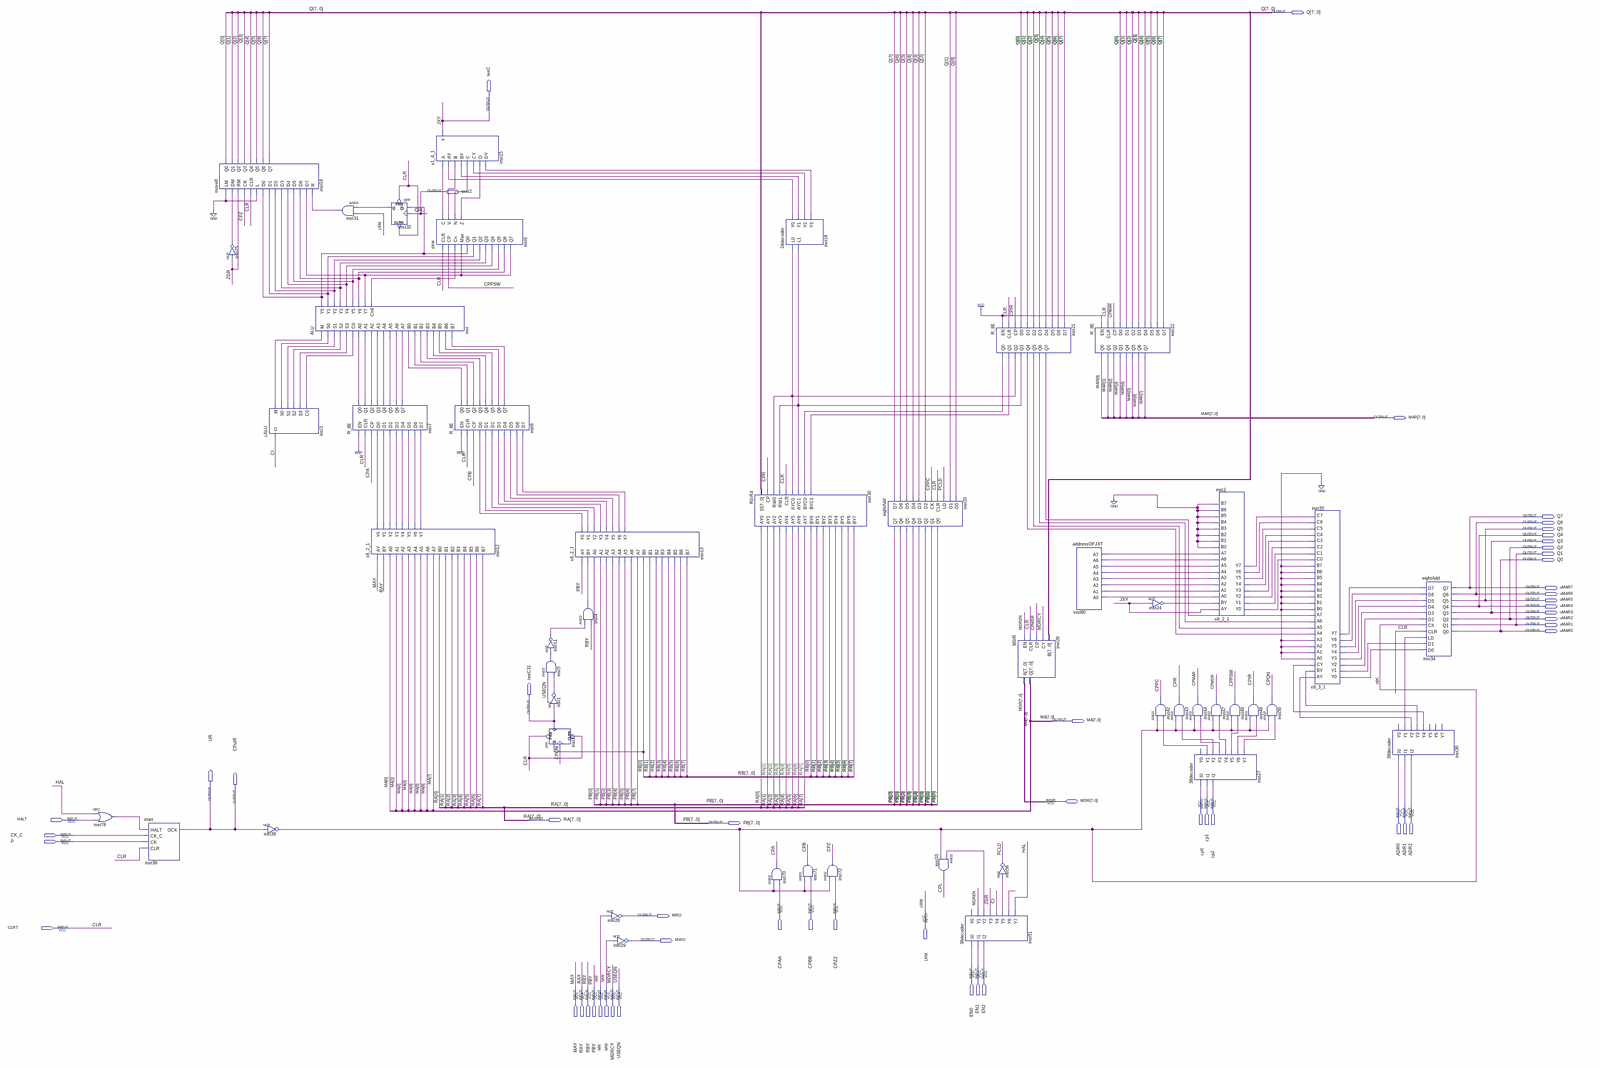
[diagram p0: schematic sheet, whole]
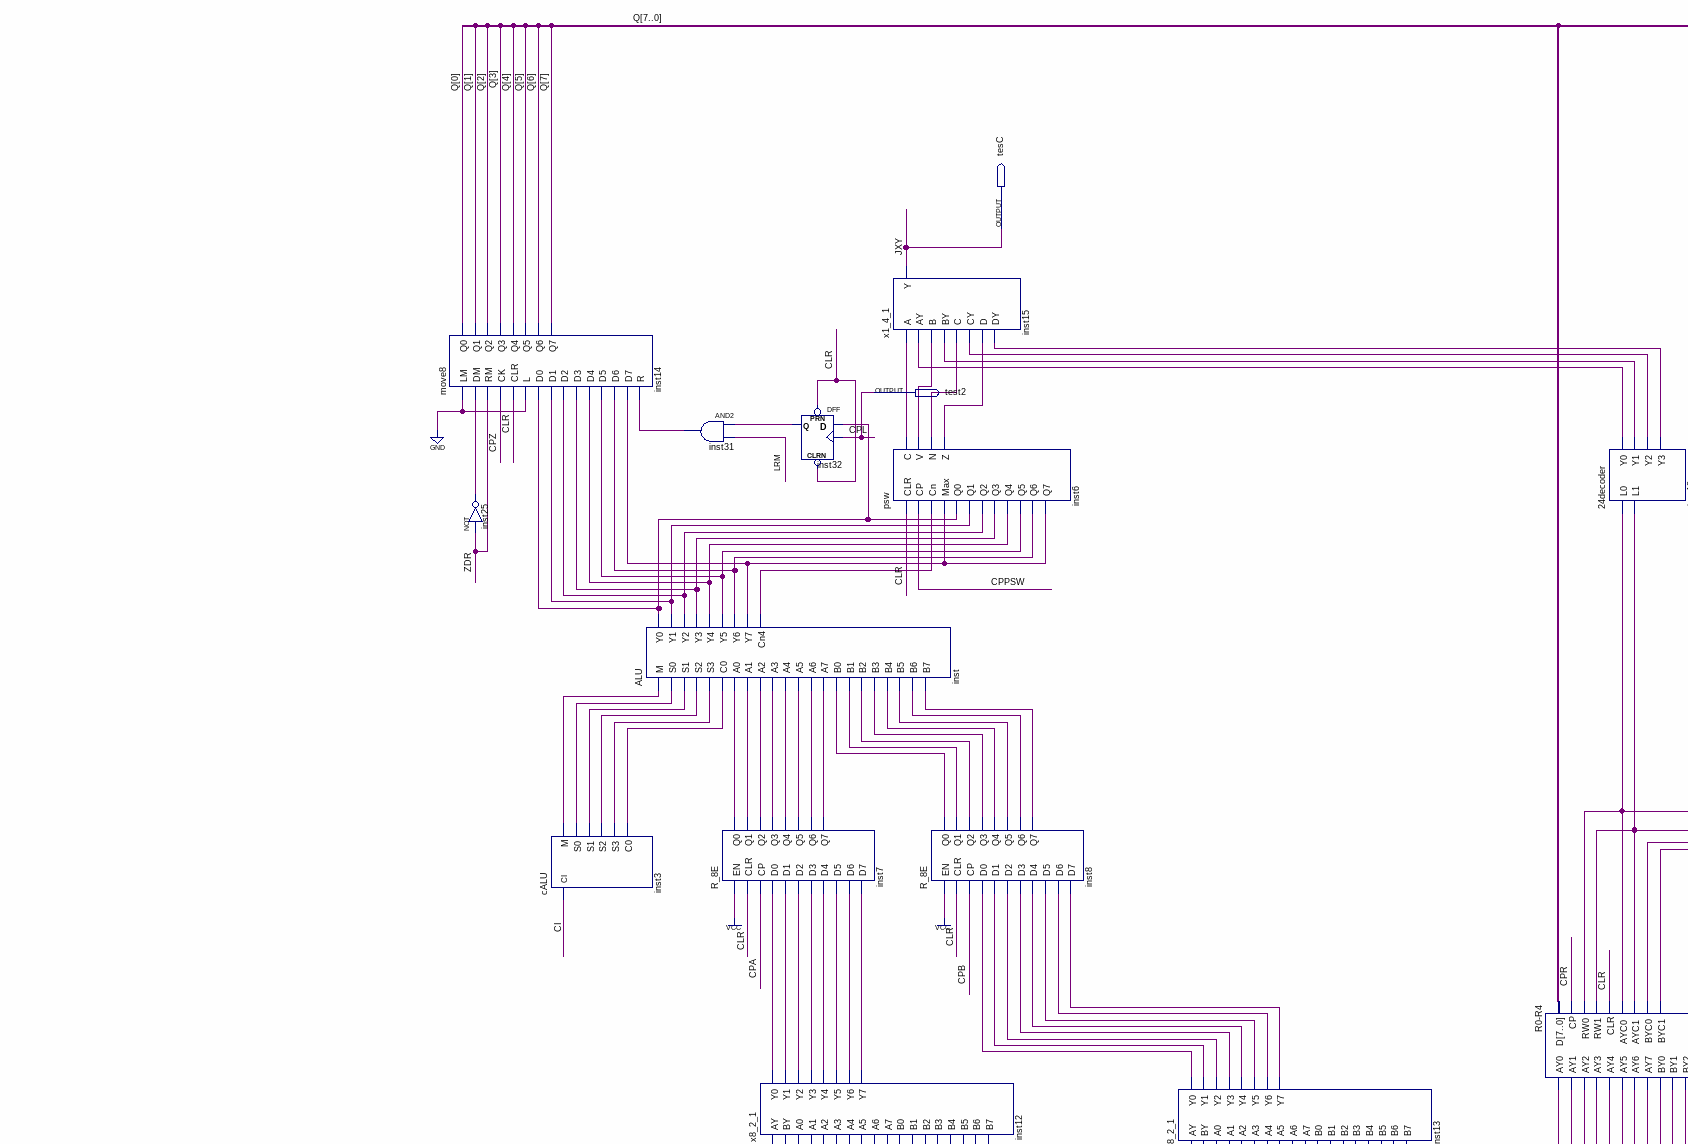
[diagram p1: schematic sheet, upper left part]
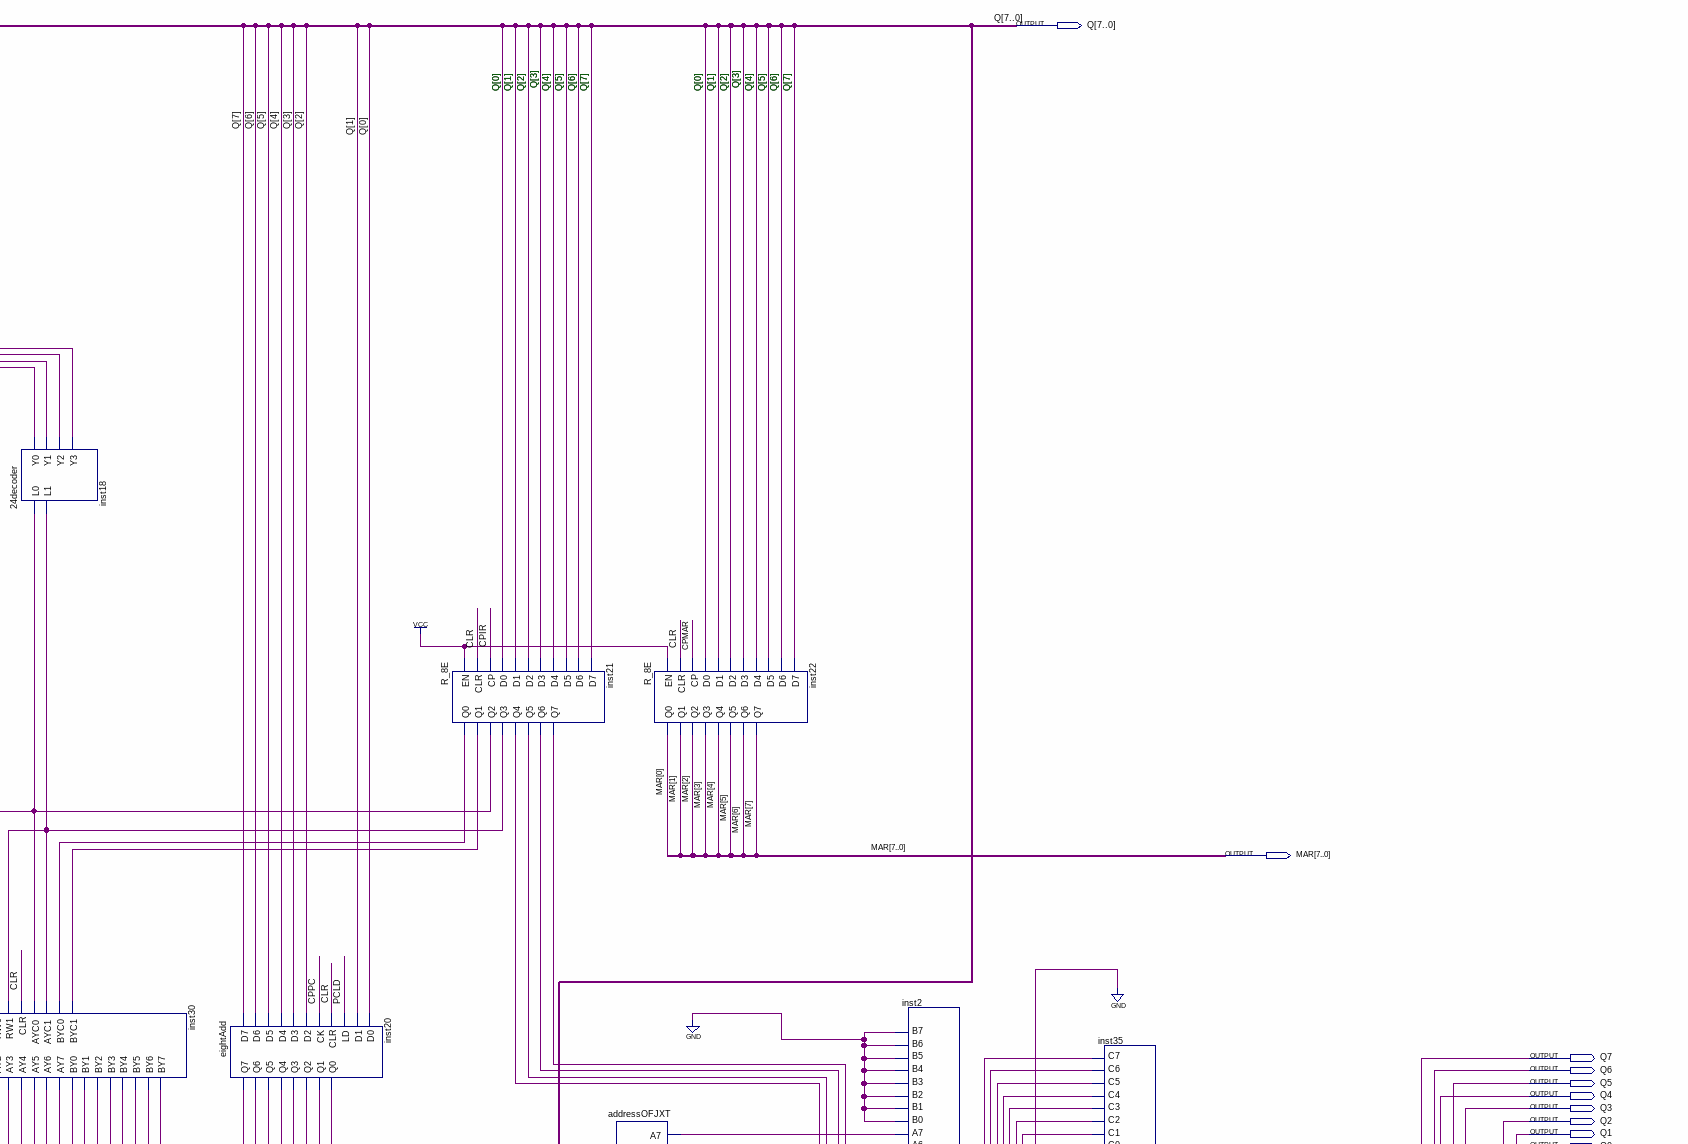
[diagram p2: schematic sheet, upper right part]
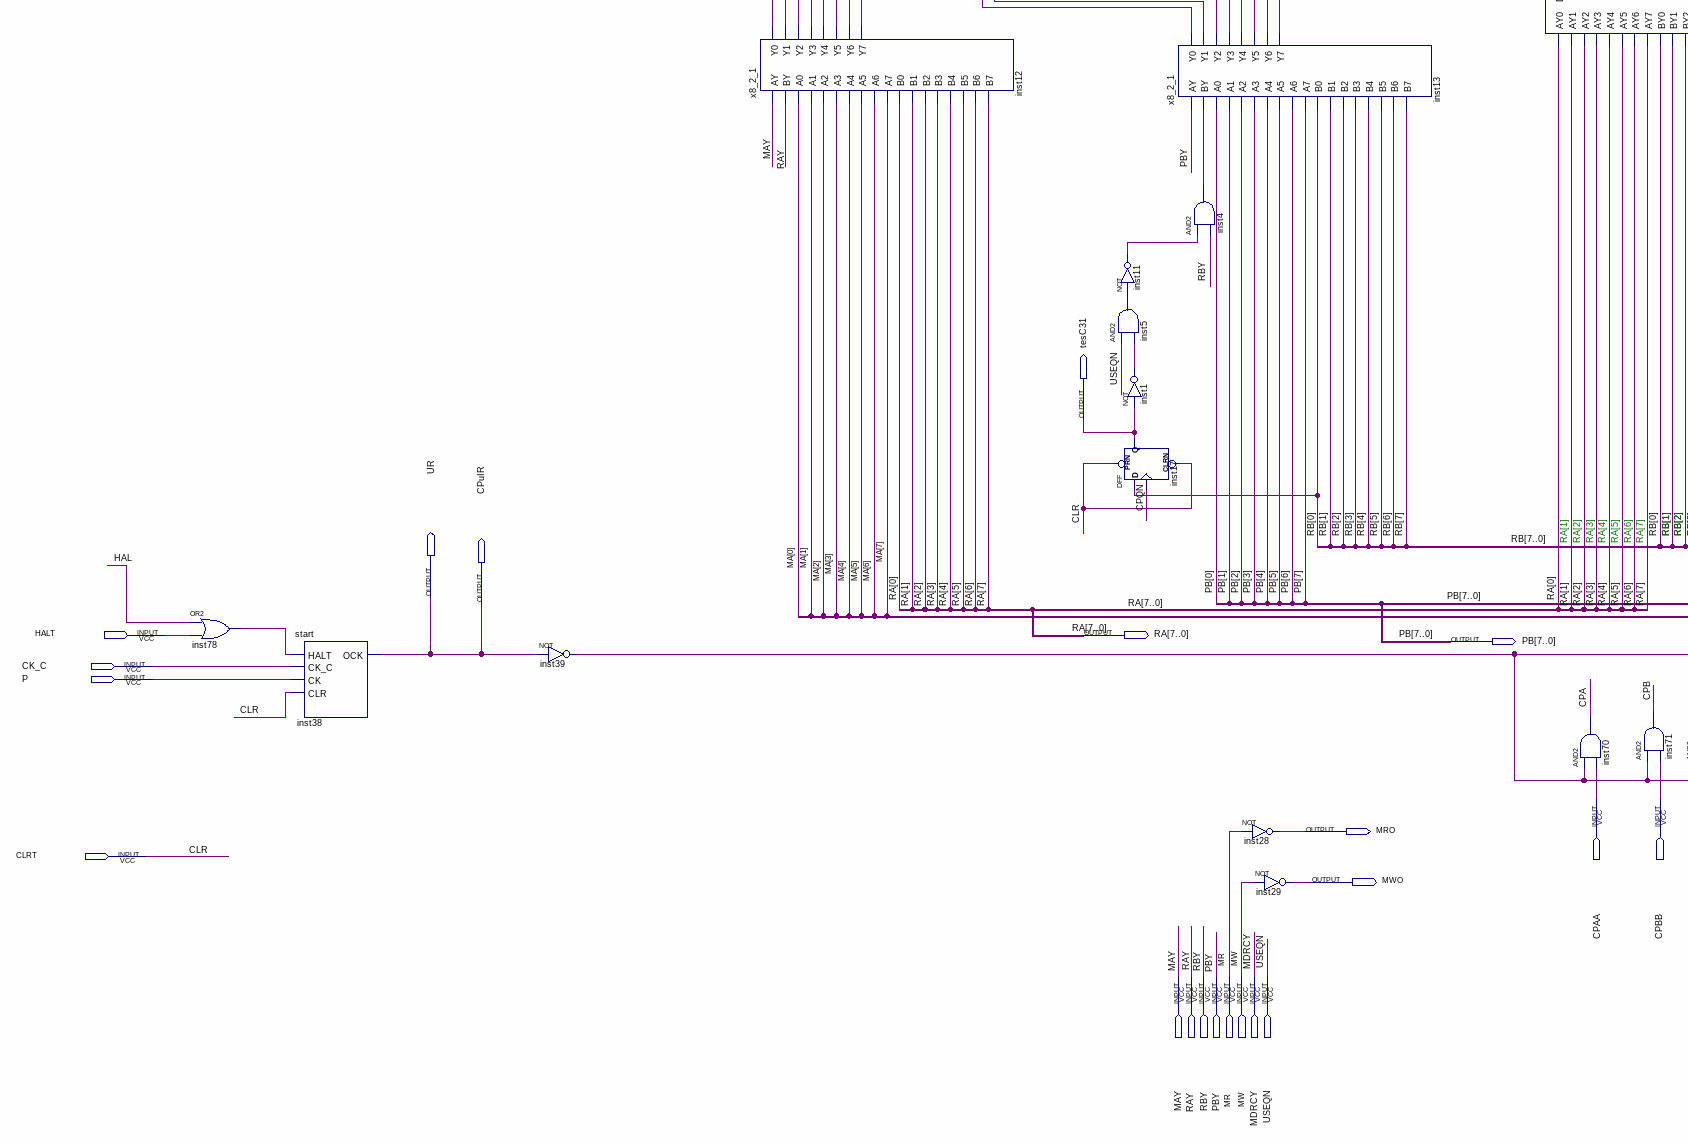
[diagram p3: schematic sheet, lower left part]
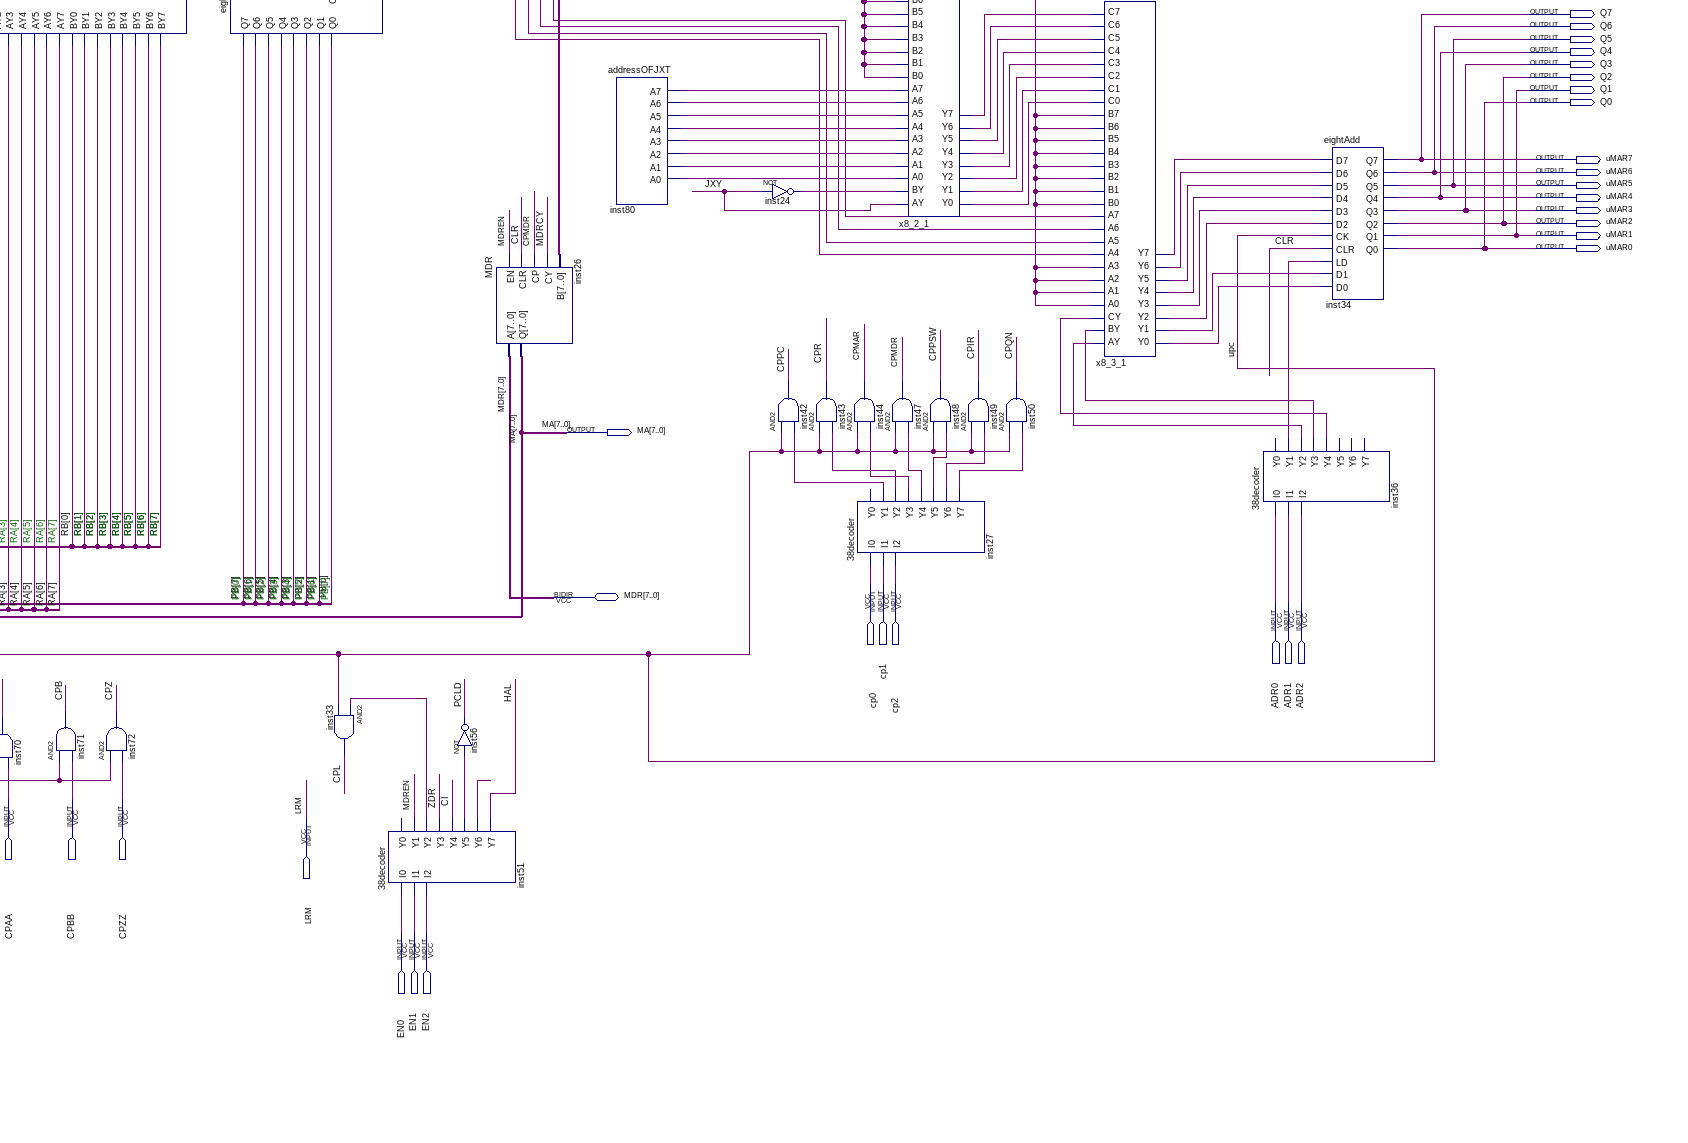
[diagram p4: schematic sheet, lower right part]
// Quartus schematic simpleMachine.bdf as structural Verilog: 48 symbols, 54 pins
module simpleMachine (
  input  cp0,
  input  cp1,
  input  cp2,
  input  ADR0,
  input  ADR1,
  input  ADR2,
  input  HALT,
  input  CK_C,
  input  P,
  input  CPAA,
  input  CPBB,
  input  CPZZ,
  input  LRM,
  input  CLRT,
  input  EN0,
  input  EN1,
  input  EN2,
  input  MAY,
  input  RAY,
  input  RBY,
  input  PBY,
  input  MR,
  input  MW,
  input  MDRCY,
  input  USEQN,
  inout  [7:0] MDR,
  output [7:0] Q,
  output tesC,
  output test2,
  output [7:0] MAR,
  output Q7,
  output Q6,
  output Q5,
  output Q4,
  output Q3,
  output Q2,
  output Q1,
  output Q0,
  output uMAR7,
  output uMAR6,
  output uMAR5,
  output uMAR4,
  output uMAR3,
  output uMAR2,
  output uMAR1,
  output uMAR0,
  output tesC31,
  output [7:0] MA,
  output UR,
  output CPuIR,
  output [7:0] RA,
  output [7:0] PB,
  output MRO,
  output MWO
);

  wire CI, CPA, CPB, CPIR, CPMAR, CPMDR, CPPC, CPPSW, CPQN, CPR, CPZ, HAL, inst1_out, inst2_y0, inst2_y1,
       inst2_y2, inst2_y3, inst2_y4, inst2_y5, inst2_y6, inst2_y7, inst3_c0, inst3_m, inst3_s0, inst3_s1,
       inst3_s2, inst3_s3, inst4_out, inst5_out, inst6_c, inst6_n, inst6_v, inst6_z, inst7_q0, inst7_q1,
       inst7_q2, inst7_q3, inst7_q4, inst7_q5, inst7_q6, inst7_q7, inst8_q0, inst8_q1, inst8_q2, inst8_q3,
       inst8_q4, inst8_q5, inst8_q6, inst8_q7, inst11_out, inst12_y0, inst12_y1, inst12_y2, inst12_y3,
       inst12_y4, inst12_y5, inst12_y6, inst12_y7, inst13_y0, inst13_y1, inst13_y2, inst13_y3, inst13_y4,
       inst13_y5, inst13_y6, inst13_y7, inst18_y0, inst18_y1, inst18_y2, inst18_y3, inst21_q0, inst21_q1,
       inst21_q2, inst21_q3, inst21_q4, inst21_q5, inst21_q6, inst21_q7, inst24_out, inst25_out, inst27_y1,
       inst27_y2, inst27_y3, inst27_y4, inst27_y5, inst27_y6, inst27_y7, inst31_out, inst32_q, inst35_y0,
       inst35_y1, inst35_y2, inst35_y3, inst35_y4, inst35_y5, inst35_y6, inst35_y7, inst36_y1, inst36_y2,
       inst36_y3, inst36_y4, inst51_y2, inst51_y5, inst51_y6, inst78_out, inst80_a0, inst80_a1, inst80_a2,
       inst80_a3, inst80_a4, inst80_a5, inst80_a6, inst80_a7, inst_cn4, inst_y0, inst_y1, inst_y2, inst_y3,
       inst_y4, inst_y5, inst_y6, inst_y7, MDREN, PCLD, upc, ZDR;
  wire [7:0] RB;

  or inst78 (inst78_out, HAL, HALT);
  start inst38 (.HALT(inst78_out), .CK_C(CK_C), .CK(P), .CLR(CLRT), .OCK(CPuIR));
  move8 inst14 (
    .LM(1'b0), .DM(inst25_out), .RM(ZDR), .CK(CPZ), .CLR(CLRT), .L(1'b0), .D0(inst_y0), .D1(inst_y1),
    .D2(inst_y2), .D3(inst_y3), .D4(inst_y4), .D5(inst_y5), .D6(inst_y6), .D7(inst_y7), .R(inst31_out),
    .Q0(Q[0]), .Q1(Q[1]), .Q2(Q[2]), .Q3(Q[3]), .Q4(Q[4]), .Q5(Q[5]), .Q6(Q[6]), .Q7(Q[7]));
  not inst25 (inst25_out, ZDR);
  cALU inst3 (.CI(CI), .M(inst3_m), .S0(inst3_s0), .S1(inst3_s1), .S2(inst3_s2), .S3(inst3_s3), .C0(inst3_c0));
  not inst39 (upc, CPuIR);
  ALU inst (
    .M(inst3_m), .S0(inst3_s0), .S1(inst3_s1), .S2(inst3_s2), .S3(inst3_s3), .C0(inst3_c0), .A0(inst7_q0),
    .A1(inst7_q1), .A2(inst7_q2), .A3(inst7_q3), .A4(inst7_q4), .A5(inst7_q5), .A6(inst7_q6), .A7(inst7_q7),
    .B0(inst8_q0), .B1(inst8_q1), .B2(inst8_q2), .B3(inst8_q3), .B4(inst8_q4), .B5(inst8_q5), .B6(inst8_q6),
    .B7(inst8_q7), .Y0(inst_y0), .Y1(inst_y1), .Y2(inst_y2), .Y3(inst_y3), .Y4(inst_y4), .Y5(inst_y5),
    .Y6(inst_y6), .Y7(inst_y7), .Cn4(inst_cn4));
  and inst31 (inst31_out, inst32_q, LRM);
  R_8E inst7 (
    .EN(1'b1), .CLR(CLRT), .CP(CPA), .D0(inst12_y0), .D1(inst12_y1), .D2(inst12_y2), .D3(inst12_y3),
    .D4(inst12_y4), .D5(inst12_y5), .D6(inst12_y6), .D7(inst12_y7), .Q0(inst7_q0), .Q1(inst7_q1),
    .Q2(inst7_q2), .Q3(inst7_q3), .Q4(inst7_q4), .Q5(inst7_q5), .Q6(inst7_q6), .Q7(inst7_q7));
  x8_2_1 inst12 (
    .AY(MAY), .BY(RAY), .A0(MA[0]), .A1(MA[1]), .A2(MA[2]), .A3(MA[3]), .A4(MA[4]), .A5(MA[5]), .A6(MA[6]),
    .A7(MA[7]), .B0(RA[0]), .B1(RA[1]), .B2(RA[2]), .B3(RA[3]), .B4(RA[4]), .B5(RA[5]), .B6(RA[6]),
    .B7(RA[7]), .Y0(inst12_y0), .Y1(inst12_y1), .Y2(inst12_y2), .Y3(inst12_y3), .Y4(inst12_y4),
    .Y5(inst12_y5), .Y6(inst12_y6), .Y7(inst12_y7));
  DFF inst32 (.CLRN(CLRT), .CLK(test2), .D(inst_y0), .PRN(CLRT), .Q(inst32_q));
  x1_4_1 inst15 (
    .A(inst6_c), .AY(inst18_y0), .B(inst6_v), .BY(inst18_y1), .C(inst6_n), .CY(inst18_y2), .D(inst6_z),
    .DY(inst18_y3), .Y(tesC));
  psw inst6 (
    .CLR(CLRT), .CP(CPPSW), .Cn(inst_cn4), .Max(inst_y7), .Q0(inst_y0), .Q1(inst_y1), .Q2(inst_y2),
    .Q3(inst_y3), .Q4(inst_y4), .Q5(inst_y5), .Q6(inst_y6), .Q7(inst_y7), .C(inst6_c), .V(inst6_v),
    .N(inst6_n), .Z(inst6_z));
  R_8E inst8 (
    .EN(1'b1), .CLR(CLRT), .CP(CPB), .D0(inst13_y0), .D1(inst13_y1), .D2(inst13_y2), .D3(inst13_y3),
    .D4(inst13_y4), .D5(inst13_y5), .D6(inst13_y6), .D7(inst13_y7), .Q0(inst8_q0), .Q1(inst8_q1),
    .Q2(inst8_q2), .Q3(inst8_q3), .Q4(inst8_q4), .Q5(inst8_q5), .Q6(inst8_q6), .Q7(inst8_q7));
  not inst11 (inst11_out, inst5_out);
  and inst5 (inst5_out, USEQN, inst1_out);
  not inst1 (inst1_out, tesC31);
  DFF inst17 (.CLRN(CLRT), .CLK(CPQN), .D(RB[0]), .PRN(CLRT), .Q(tesC31));
  x8_2_1 inst13 (
    .AY(PBY), .BY(inst4_out), .A0(PB[0]), .A1(PB[1]), .A2(PB[2]), .A3(PB[3]), .A4(PB[4]), .A5(PB[5]),
    .A6(PB[6]), .A7(PB[7]), .B0(RB[0]), .B1(RB[1]), .B2(RB[2]), .B3(RB[3]), .B4(RB[4]), .B5(RB[5]),
    .B6(RB[6]), .B7(RB[7]), .Y0(inst13_y0), .Y1(inst13_y1), .Y2(inst13_y2), .Y3(inst13_y3), .Y4(inst13_y4),
    .Y5(inst13_y5), .Y6(inst13_y6), .Y7(inst13_y7));
  and inst4 (inst4_out, inst11_out, RBY);
  not inst28 (MRO, MR);
  not inst29 (MWO, MW);
  \R0-R4  inst30 (
    .D(Q), .CP(CPR), .RW0(inst21_q2), .RW1(inst21_q3), .CLR(CLRT), .AYC0(inst21_q2), .AYC1(inst21_q3),
    .BYC0(inst21_q0), .BYC1(inst21_q1), .AY0(RA[0]), .AY1(RA[1]), .AY2(RA[2]), .AY3(RA[3]), .AY4(RA[4]),
    .AY5(RA[5]), .AY6(RA[6]), .AY7(RA[7]), .BY0(RB[0]), .BY1(RB[1]), .BY2(RB[2]), .BY3(RB[3]), .BY4(RB[4]),
    .BY5(RB[5]), .BY6(RB[6]), .BY7(RB[7]));
  and inst70 (CPA, upc, CPAA);
  \24decoder  inst18 (.L0(inst21_q2), .L1(inst21_q3), .Y0(inst18_y0), .Y1(inst18_y1), .Y2(inst18_y2), .Y3(inst18_y3));
  and inst71 (CPB, upc, CPBB);
  and inst72 (CPZ, upc, CPZZ);
  eightAdd inst20 (
    .D7(Q[7]), .D6(Q[6]), .D5(Q[5]), .D4(Q[4]), .D3(Q[3]), .D2(Q[2]), .CK(CPPC), .CLR(CLRT), .LD(PCLD),
    .D1(Q[1]), .D0(Q[0]), .Q7(PB[7]), .Q6(PB[6]), .Q5(PB[5]), .Q4(PB[4]), .Q3(PB[3]), .Q2(PB[2]), .Q1(PB[1]),
    .Q0(PB[0]));
  and inst33 (test2, inst51_y2, upc);
  \38decoder  inst51 (
    .I0(EN0), .I1(EN1), .I2(EN2), .Y1(MDREN), .Y2(inst51_y2), .Y3(ZDR), .Y4(CI), .Y5(inst51_y5),
    .Y6(inst51_y6), .Y7(HAL));  // open: Y0
  R_8E inst21 (
    .EN(1'b1), .CLR(CLRT), .CP(CPIR), .D0(Q[0]), .D1(Q[1]), .D2(Q[2]), .D3(Q[3]), .D4(Q[4]), .D5(Q[5]),
    .D6(Q[6]), .D7(Q[7]), .Q0(inst21_q0), .Q1(inst21_q1), .Q2(inst21_q2), .Q3(inst21_q3), .Q4(inst21_q4),
    .Q5(inst21_q5), .Q6(inst21_q6), .Q7(inst21_q7));
  not inst56 (PCLD, inst51_y5);
  MDR inst26 (.EN(MDREN), .CLR(CLRT), .CP(CPMDR), .CY(MDRCY), .B(Q), .Q(MA), .A(MDR));
  addressOFJXT inst80 (
    .A7(inst80_a7), .A6(inst80_a6), .A5(inst80_a5), .A4(inst80_a4), .A3(inst80_a3), .A2(inst80_a2),
    .A1(inst80_a1), .A0(inst80_a0));
  R_8E inst22 (
    .EN(1'b1), .CLR(CLRT), .CP(CPMAR), .D0(Q[0]), .D1(Q[1]), .D2(Q[2]), .D3(Q[3]), .D4(Q[4]), .D5(Q[5]),
    .D6(Q[6]), .D7(Q[7]), .Q0(MAR[0]), .Q1(MAR[1]), .Q2(MAR[2]), .Q3(MAR[3]), .Q4(MAR[4]), .Q5(MAR[5]),
    .Q6(MAR[6]), .Q7(MAR[7]));
  not inst24 (inst24_out, tesC);
  and inst42 (CPPC, upc, inst27_y1);
  and inst43 (CPR, upc, inst27_y2);
  and inst44 (CPMAR, upc, inst27_y3);
  \38decoder  inst27 (
    .I0(cp0), .I1(cp1), .I2(cp2), .Y1(inst27_y1), .Y2(inst27_y2), .Y3(inst27_y3), .Y4(inst27_y4),
    .Y5(inst27_y5), .Y6(inst27_y6), .Y7(inst27_y7));  // open: Y0
  x8_2_1 inst2 (
    .AY(tesC), .BY(inst24_out), .A0(inst80_a0), .A1(inst80_a1), .A2(inst80_a2), .A3(inst80_a3),
    .A4(inst80_a4), .A5(inst80_a5), .A6(inst80_a6), .A7(inst80_a7), .B0(1'b0), .B1(1'b0), .B2(1'b0),
    .B3(1'b0), .B4(1'b0), .B5(1'b0), .B6(1'b0), .B7(1'b0), .Y0(inst2_y0), .Y1(inst2_y1), .Y2(inst2_y2),
    .Y3(inst2_y3), .Y4(inst2_y4), .Y5(inst2_y5), .Y6(inst2_y6), .Y7(inst2_y7));
  and inst47 (CPMDR, upc, inst27_y4);
  and inst48 (CPPSW, upc, inst27_y5);
  and inst49 (CPIR, upc, inst27_y6);
  and inst50 (CPQN, upc, inst27_y7);
  x8_3_1 inst35 (
    .AY(inst36_y2), .BY(inst36_y3), .CY(inst36_y4), .A0(1'b0), .A1(1'b0), .A2(1'b0), .A3(1'b0),
    .A4(inst21_q4), .A5(inst21_q5), .A6(inst21_q6), .A7(inst21_q7), .B0(1'b0), .B1(1'b0), .B2(1'b0),
    .B3(1'b0), .B4(1'b0), .B5(1'b0), .B6(1'b0), .B7(1'b0), .C0(inst2_y0), .C1(inst2_y1), .C2(inst2_y2),
    .C3(inst2_y3), .C4(inst2_y4), .C5(inst2_y5), .C6(inst2_y6), .C7(inst2_y7), .Y0(inst35_y0),
    .Y1(inst35_y1), .Y2(inst35_y2), .Y3(inst35_y3), .Y4(inst35_y4), .Y5(inst35_y5), .Y6(inst35_y6),
    .Y7(inst35_y7));
  \38decoder  inst36 (
    .I0(ADR0), .I1(ADR1), .I2(ADR2), .Y1(inst36_y1), .Y2(inst36_y2), .Y3(inst36_y3), .Y4(inst36_y4));  // open: Y0, Y5, Y6, Y7
  eightAdd inst34 (
    .D7(inst35_y7), .D6(inst35_y6), .D5(inst35_y5), .D4(inst35_y4), .D3(inst35_y3), .D2(inst35_y2), .CK(upc),
    .CLR(CLRT), .LD(inst36_y1), .D1(inst35_y1), .D0(inst35_y0), .Q7(Q[7]), .Q6(Q[6]), .Q5(Q[5]), .Q4(Q[4]),
    .Q3(Q[3]), .Q2(Q[2]), .Q1(Q[1]), .Q0(Q[0]));

  assign Q0 = Q[0];
  assign Q1 = Q[1];
  assign Q2 = Q[2];
  assign Q3 = Q[3];
  assign Q4 = Q[4];
  assign Q5 = Q[5];
  assign Q6 = Q[6];
  assign Q7 = Q[7];
  assign uMAR0 = Q[0];
  assign uMAR1 = Q[1];
  assign uMAR2 = Q[2];
  assign uMAR3 = Q[3];
  assign uMAR4 = Q[4];
  assign uMAR5 = Q[5];
  assign uMAR6 = Q[6];
  assign uMAR7 = Q[7];
  assign UR = CPuIR;

  // Other names for the same wires on the sheet: CLR = CLRT; JXY = tesC; CPL = test2

  // Notes on the sheet:
  //   Q[3]
  //   Q[3]
  //   Q[0]
  //   Q[1]
  //   Q[2]
  //   Q[4]
  //   Q[5]
  //   Q[6]
  //   Q[7]
  //   Q[0]
  //   Q[1]
  //   Q[2]
  //   Q[4]
  //   Q[5]
  //   Q[6]
  //   Q[7]
  //   RB[1]
  //   RB[2]
  //   RB[3]
  //   RB[4]
  //   RB[5]
  //   RB[6]
  //   RB[7]
  //   RA[1]
  //   RA[2]
  //   RA[3]
  //   RA[4]
  //   RA[5]
  //   RA[6]
  //   RA[7]
  //   PB[0]
  //   PB[1]
  //   PB[2]
  //   PB[3]
  //   PB[4]
  //   PB[5]
  //   PB[6]
  //   PB[7]
endmodule
